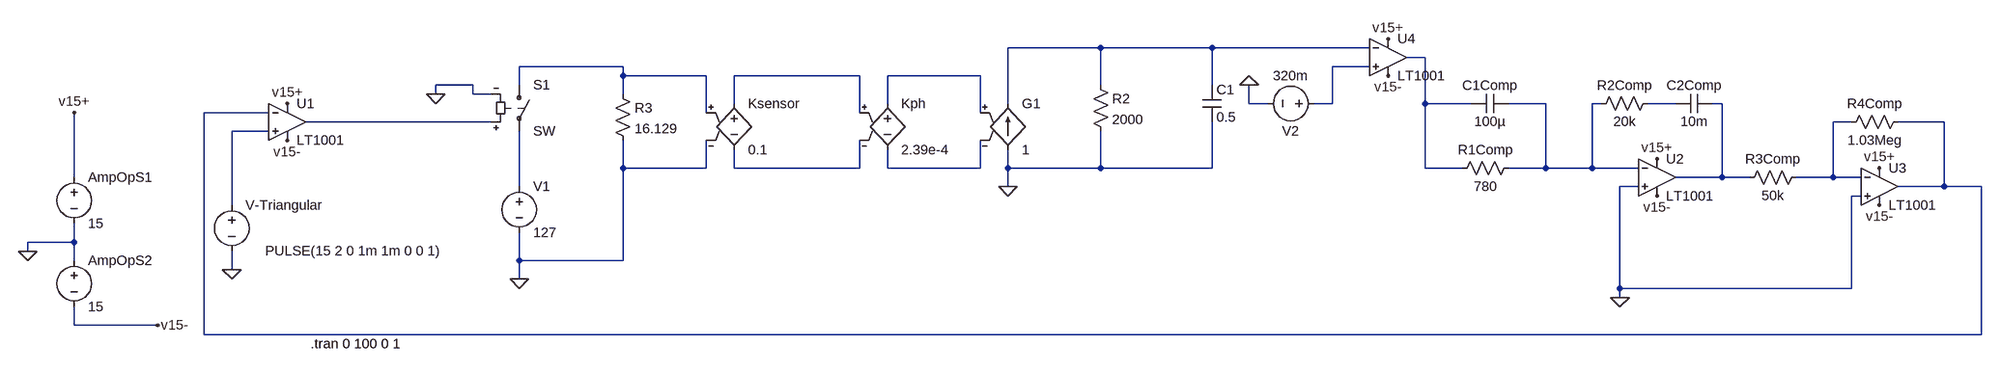
[diagram p0: schematic ProjetoChaleira.asc]
ProjetoChaleira.asc, the LTspice schematic file:
Version 4
SHEET 1 4244 948
WIRE 2720 -80 2560 -80
WIRE 2912 -80 2720 -80
WIRE 3184 -80 2912 -80
WIRE 3280 -64 3248 -64
WIRE 1872 -48 1568 -48
WIRE 3184 -48 3120 -48
WIRE 1872 -32 1872 -48
WIRE 2016 -32 1872 -32
WIRE 2304 -32 2064 -32
WIRE 2512 -32 2352 -32
WIRE 1488 -16 1424 -16
WIRE 1568 -16 1568 -48
WIRE 2720 -16 2720 -80
WIRE 2912 -16 2912 -80
WIRE 1424 0 1424 -16
WIRE 1488 0 1488 -16
WIRE 1520 0 1488 0
WIRE 1872 0 1872 -32
WIRE 2064 16 2064 -32
WIRE 2352 16 2352 -32
WIRE 2560 16 2560 -80
WIRE 2976 16 2976 -16
WIRE 3008 16 2976 16
WIRE 3120 16 3120 -48
WIRE 3120 16 3088 16
WIRE 3280 16 3280 -64
WIRE 3360 16 3280 16
WIRE 3488 16 3424 16
WIRE 3584 16 3568 16
WIRE 3712 16 3664 16
WIRE 3792 16 3776 16
WIRE 1136 32 1024 32
WIRE 2016 32 2016 -32
WIRE 2304 32 2304 -32
WIRE 2512 32 2512 -32
WIRE 1520 48 1200 48
WIRE 4016 48 3984 48
WIRE 4176 48 4096 48
WIRE 1136 64 1072 64
WIRE 1872 128 1872 80
WIRE 2016 128 2016 80
WIRE 2016 128 1872 128
WIRE 2064 128 2064 96
WIRE 2304 128 2304 80
WIRE 2304 128 2064 128
WIRE 2352 128 2352 96
WIRE 2512 128 2512 80
WIRE 2512 128 2352 128
WIRE 2560 128 2560 96
WIRE 2720 128 2720 64
WIRE 2720 128 2560 128
WIRE 2912 128 2912 48
WIRE 2912 128 2720 128
WIRE 3280 128 3280 16
WIRE 3344 128 3280 128
WIRE 3488 128 3488 16
WIRE 3488 128 3424 128
WIRE 3568 128 3568 16
WIRE 3568 128 3488 128
WIRE 3648 128 3568 128
WIRE 800 144 800 32
WIRE 3792 144 3792 16
WIRE 3792 144 3712 144
WIRE 3840 144 3792 144
WIRE 3984 144 3984 48
WIRE 3984 144 3920 144
WIRE 4032 144 3984 144
WIRE 1568 160 1568 64
WIRE 2560 160 2560 128
WIRE 3648 160 3616 160
WIRE 4176 160 4176 48
WIRE 4176 160 4096 160
WIRE 4240 160 4176 160
WIRE 4032 176 4016 176
WIRE 1072 192 1072 64
WIRE 800 256 800 224
WIRE 800 256 720 256
WIRE 720 272 720 256
WIRE 800 288 800 256
WIRE 1568 288 1568 240
WIRE 1872 288 1872 128
WIRE 1872 288 1568 288
WIRE 1072 304 1072 272
WIRE 1568 320 1568 288
WIRE 3616 336 3616 160
WIRE 4016 336 4016 176
WIRE 4016 336 3616 336
WIRE 3616 352 3616 336
WIRE 800 400 800 368
WIRE 944 400 800 400
WIRE 1024 416 1024 32
WIRE 4240 416 4240 160
WIRE 4240 416 1024 416
FLAG 1072 304 0
FLAG 720 272 0
FLAG 1168 16 v15+
FLAG 800 32 v15+
FLAG 1168 80 v15-
FLAG 944 400 v15-
FLAG 1568 320 0
FLAG 1424 0 0
FLAG 2560 160 0
FLAG 3680 112 v15+
FLAG 4064 128 v15+
FLAG 4064 192 v15-
FLAG 3680 176 v15-
FLAG 3616 352 0
FLAG 2976 -16 0
FLAG 3216 -96 v15+
FLAG 3216 -32 v15-
SYMBOL voltage 1072 176 R0
WINDOW 123 0 0 Left 0
WINDOW 39 0 0 Left 0
WINDOW 3 58 95 Left 2
SYMATTR InstName V-Triangular
SYMATTR Value PULSE(15 2 0 1m 1m 0 0 1)
SYMBOL voltage 800 128 R0
WINDOW 123 0 0 Left 0
WINDOW 39 0 0 Left 0
SYMATTR InstName AmpOpS1
SYMATTR Value 15
SYMBOL voltage 800 272 R0
WINDOW 123 0 0 Left 0
WINDOW 39 0 0 Left 0
SYMATTR InstName AmpOpS2
SYMATTR Value 15
SYMBOL Opamps\\LT1001 1168 -16 R0
SYMATTR InstName U1
SYMBOL res 2704 -32 R0
SYMATTR InstName R2
SYMATTR Value 2000
SYMBOL cap 2896 -16 R0
SYMATTR InstName C1
SYMATTR Value 0.5
SYMBOL res 1856 -16 R0
SYMATTR InstName R3
SYMATTR Value 16.129
SYMBOL voltage 1568 144 R0
WINDOW 123 0 0 Left 0
WINDOW 39 0 0 Left 0
SYMATTR InstName V1
SYMATTR Value 127
SYMBOL sw 1568 -32 R0
SYMATTR InstName S1
SYMBOL e 2352 0 R0
SYMATTR InstName Kph
SYMATTR Value 2.39e-4
SYMBOL e 2064 0 R0
SYMATTR InstName Ksensor
SYMATTR Value 0.1
SYMBOL g 2560 0 R0
SYMATTR InstName G1
SYMATTR Value 1
SYMBOL res 3440 112 R90
WINDOW 0 0 56 VBottom 2
WINDOW 3 32 56 VTop 2
SYMATTR InstName R1Comp
SYMATTR Value 780
SYMBOL cap 3424 0 R90
WINDOW 0 0 32 VBottom 2
WINDOW 3 32 32 VTop 2
SYMATTR InstName C1Comp
SYMATTR Value 100µ
SYMBOL res 3680 0 R90
WINDOW 0 0 56 VBottom 2
WINDOW 3 32 56 VTop 2
SYMATTR InstName R2Comp
SYMATTR Value 20k
SYMBOL cap 3776 0 R90
WINDOW 0 0 32 VBottom 2
WINDOW 3 32 32 VTop 2
SYMATTR InstName C2Comp
SYMATTR Value 10m
SYMBOL res 3936 128 R90
WINDOW 0 0 56 VBottom 2
WINDOW 3 32 56 VTop 2
SYMATTR InstName R3Comp
SYMATTR Value 50k
SYMBOL res 4112 32 R90
WINDOW 0 0 56 VBottom 2
WINDOW 3 32 56 VTop 2
SYMATTR InstName R4Comp
SYMATTR Value 1.03Meg
SYMBOL Opamps\\LT1001 3680 80 R0
SYMATTR InstName U2
SYMBOL Opamps\\LT1001 4064 96 R0
SYMATTR InstName U3
SYMBOL Opamps\\LT1001 3216 -128 R0
SYMATTR InstName U4
SYMBOL voltage 3104 16 R90
WINDOW 0 32 56 VTop 2
WINDOW 3 -32 56 VBottom 2
WINDOW 123 0 0 Left 0
WINDOW 39 0 0 Left 0
SYMATTR InstName V2
SYMATTR Value 320m
TEXT 1208 432 Left 2 !.tran 0 100 0 1

The netlist it stands for:
* ProjetoChaleira.asc
V-Triangular N013 0 PULSE(15 2 0 1m 1m 0 0 1)
V§AmpOpS1 v15+ 0 15
V§AmpOpS2 0 v15- 15
XU1 N013 N010 v15+ v15- N011 LT1001  ; pins In+ In- V+ V- OUT
R2 N001 0 2000
C1 N001 0 0.5
R3 N003 0 16.129
V1 N016 0 127
S1 N003 N016 N011 0 SW
E§Kph N006 N015 N005 N014 2.39e-4
E§Ksensor N005 N014 N003 0 0.1
G1 0 N001 N006 N015 1
R1Comp N007 N002 780
C1Comp N007 N002 100µ
R2Comp N008 N007 20k
C2Comp N009 N008 10m
R3Comp N012 N009 50k
R4Comp N010 N012 1.03Meg
XU2 0 N007 v15+ v15- N009 LT1001  ; pins In+ In- V+ V- OUT
XU3 0 N012 v15+ v15- N010 LT1001  ; pins In+ In- V+ V- OUT
XU4 N004 N001 v15+ v15- N002 LT1001  ; pins In+ In- V+ V- OUT
V2 N004 0 320m
.tran 0 100 0 1
.lib LTC.lib
.backanno
.end